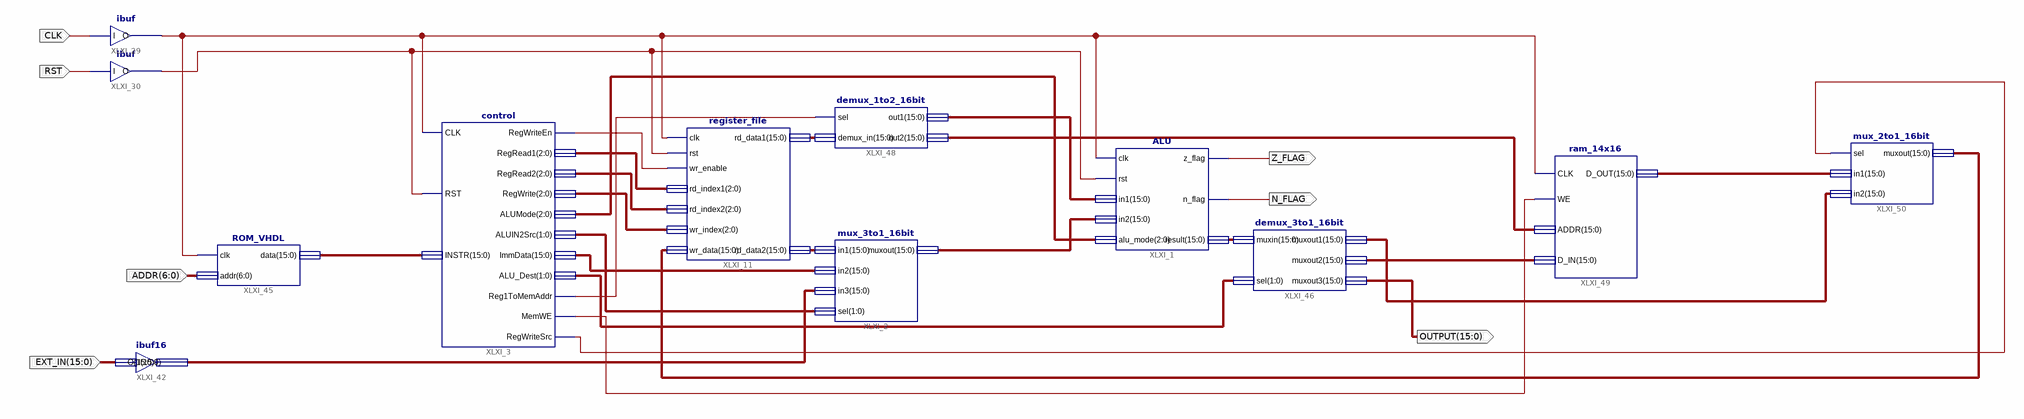
[diagram p0: schematic sheet 1]
// Xilinx ISE schematic cpu_pipelined_tb.sch (spartan3e) as structural Verilog: 12 symbols, 7 ports
module cpu_pipelined_tb (
  input  [15:0] EXT_IN,
  input  RST,
  input  CLK,
  input  [6:0] ADDR,
  output [15:0] OUTPUT,
  output N_FLAG,
  output Z_FLAG
);

  wire MEMWE, XLXN_8, XLXN_316, XLXN_340, XLXN_372, XLXN_454;
  wire [1:0] XLXN_104, XLXN_455;
  wire [2:0] XLXN_23, XLXN_24, XLXN_48, XLXN_49;
  wire [15:0] ALU_RESULT, MEMADDR, MEMDATA, MEMOUT, WBDATA, XLXN_4, XLXN_97, XLXN_103, XLXN_206, XLXN_207,
       XLXN_341, XLXN_342, XLXN_368;

  demux_3to1_16bit XLXI_46 (
    .muxin(ALU_RESULT), .sel(XLXN_455), .muxout1(XLXN_368), .muxout2(MEMDATA), .muxout3(OUTPUT));
  mux_3to1_16bit XLXI_2 (.in1(XLXN_97), .in2(XLXN_4), .in3(XLXN_207), .sel(XLXN_104), .muxout(XLXN_103));
  demux_1to2_16bit XLXI_48 (.sel(XLXN_454), .demux_in(XLXN_341), .out1(XLXN_342), .out2(MEMADDR));
  ALU XLXI_1 (
    .clk(XLXN_316), .rst(XLXN_340), .in1(XLXN_342), .in2(XLXN_103), .alu_mode(XLXN_49), .z_flag(Z_FLAG),
    .n_flag(N_FLAG), .result(ALU_RESULT));
  ram_14x16 XLXI_49 (.CLK(XLXN_316), .WE(MEMWE), .ADDR(MEMADDR), .D_OUT(MEMOUT), .D_IN(MEMDATA));
  mux_2to1_16bit XLXI_50 (.sel(XLXN_372), .in1(MEMOUT), .in2(XLXN_368), .muxout(WBDATA));
  ibuf16 XLXI_42 (.I(EXT_IN), .O(XLXN_207));
  ibuf XLXI_30 (.I(RST), .O(XLXN_340));
  ibuf XLXI_29 (.I(CLK), .O(XLXN_316));
  ROM_VHDL XLXI_45 (.clk(XLXN_316), .addr(ADDR), .data(XLXN_206));
  register_file XLXI_11 (
    .wr_enable(XLXN_8), .rd_index1(XLXN_23), .rd_index2(XLXN_24), .wr_index(XLXN_48), .wr_data(WBDATA),
    .rd_data2(XLXN_97), .rst(XLXN_340), .clk(XLXN_316), .rd_data1(XLXN_341));
  control XLXI_3 (
    .CLK(XLXN_316), .RST(XLXN_340), .INSTR(XLXN_206), .RegWriteEn(XLXN_8), .Reg1ToMemAddr(XLXN_454),
    .MemWE(MEMWE), .RegRead1(XLXN_23), .RegRead2(XLXN_24), .RegWrite(XLXN_48), .ALUMode(XLXN_49),
    .ImmData(XLXN_4), .ALUIN2Src(XLXN_104), .ALU_Dest(XLXN_455), .RegWriteSrc(XLXN_372));
endmodule
